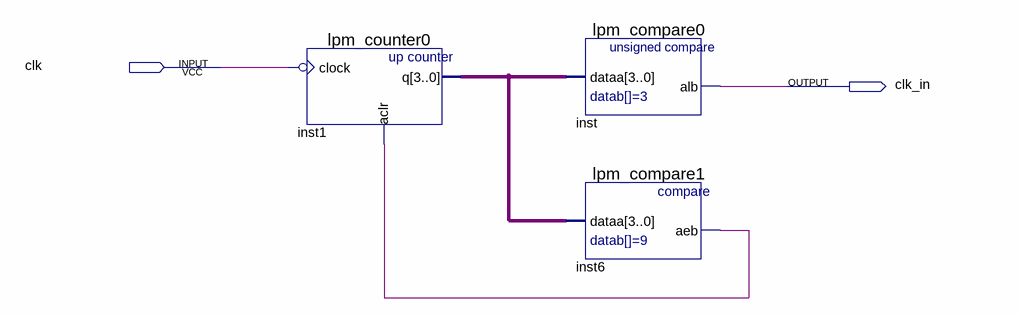
[diagram p0: schematic sheet]
// Quartus schematic scheme1.bdf as structural Verilog: 3 symbols, 2 pins
module scheme1 (
  input  clk,
  output clk_in
);

  wire inst6_aeb;
  wire [3:0] inst1_q;

  lpm_counter0 inst1 (.clock(~clk), .aclr(inst6_aeb), .q(inst1_q));
  lpm_compare0 inst (.dataa(inst1_q), .alb(clk_in));
  lpm_compare1 inst6 (.dataa(inst1_q), .aeb(inst6_aeb));
endmodule
